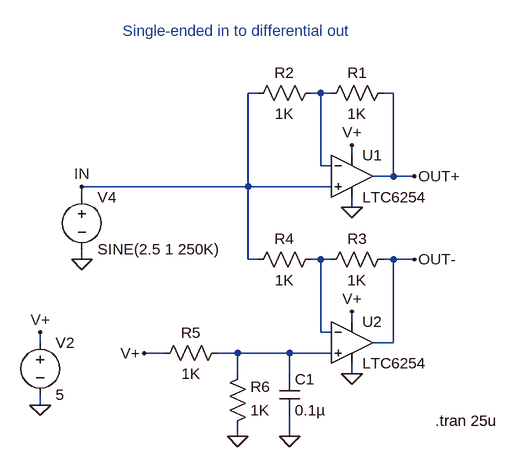
[diagram p0: schematic 6254.asc]
6254.asc, the LTspice schematic file:
Version 4
SHEET 1 1240 700
WIRE 416 -1232 400 -1232
WIRE 512 -1232 496 -1232
WIRE 528 -1232 512 -1232
WIRE 624 -1232 608 -1232
WIRE 560 -1136 560 -1152
WIRE 512 -1120 512 -1232
WIRE 528 -1120 512 -1120
WIRE 624 -1104 624 -1232
WIRE 624 -1104 592 -1104
WIRE 656 -1104 624 -1104
WIRE 400 -1088 400 -1232
WIRE 400 -1088 144 -1088
WIRE 528 -1088 400 -1088
WIRE 144 -1072 144 -1088
WIRE 560 -1056 560 -1072
WIRE 144 -976 144 -992
WIRE 400 -976 400 -1088
WIRE 416 -976 400 -976
WIRE 512 -976 496 -976
WIRE 528 -976 512 -976
WIRE 624 -976 608 -976
WIRE 656 -976 624 -976
WIRE 560 -880 560 -896
WIRE 512 -864 512 -976
WIRE 528 -864 512 -864
WIRE 80 -848 80 -864
WIRE 624 -848 624 -976
WIRE 624 -848 592 -848
WIRE 272 -832 240 -832
WIRE 384 -832 352 -832
WIRE 464 -832 384 -832
WIRE 528 -832 464 -832
WIRE 384 -800 384 -832
WIRE 464 -800 464 -832
WIRE 560 -800 560 -816
WIRE 80 -752 80 -768
WIRE 384 -704 384 -720
WIRE 464 -704 464 -736
FLAG 80 -864 V+
FLAG 80 -752 0
FLAG 144 -976 0
FLAG 656 -1104 OUT+
FLAG 560 -1152 V+
FLAG 560 -1056 0
FLAG 144 -1088 IN
FLAG 560 -896 V+
FLAG 560 -800 0
FLAG 656 -976 OUT-
FLAG 240 -832 V+
FLAG 464 -704 0
FLAG 384 -704 0
SYMBOL voltage 80 -864 R0
SYMATTR InstName V2
SYMATTR Value 5
SYMBOL voltage 144 -1088 R0
WINDOW 123 24 146 Left 0
WINDOW 39 24 125 Left 0
SYMATTR InstName V4
SYMATTR Value SINE(2.5 1 250K)
SYMBOL res 624 -1248 R90
WINDOW 0 0 56 VBottom 0
WINDOW 3 32 56 VTop 0
SYMATTR InstName R1
SYMATTR Value 1K
SYMBOL res 512 -1248 R90
WINDOW 0 0 56 VBottom 0
WINDOW 3 32 56 VTop 0
SYMATTR InstName R2
SYMATTR Value 1K
SYMBOL res 624 -992 R90
WINDOW 0 0 56 VBottom 0
WINDOW 3 32 56 VTop 0
SYMATTR InstName R3
SYMATTR Value 1K
SYMBOL res 512 -992 R90
WINDOW 0 0 56 VBottom 0
WINDOW 3 32 56 VTop 0
SYMATTR InstName R4
SYMATTR Value 1K
SYMBOL res 368 -848 R90
WINDOW 0 0 56 VBottom 0
WINDOW 3 32 56 VTop 0
SYMATTR InstName R5
SYMATTR Value 1K
SYMBOL res 368 -704 M180
WINDOW 0 36 76 Left 0
WINDOW 3 36 40 Left 0
SYMATTR InstName R6
SYMATTR Value 1K
SYMBOL cap 448 -800 R0
SYMATTR InstName C1
SYMATTR Value 0.1µ
SYMBOL Opamps\\LTC6254 560 -1104 R0
SYMATTR InstName U1
SYMBOL Opamps\\LTC6254 560 -848 R0
SYMATTR InstName U2
TEXT 688 -728 Left 0 !.tran 25u
TEXT 384 -1312 Bottom 0 ;Single-ended in to differential out

The netlist it stands for:
* 6254.asc
V2 V+ 0 5
V4 IN 0 SINE(2.5 1 250K)
R1 OUT+ N001 1K
R2 N001 IN 1K
R3 OUT- N002 1K
R4 N002 IN 1K
R5 N003 V+ 1K
R6 0 N003 1K
C1 N003 0 0.1µ
* U1: LTC6254 (symbol Opamps\LTC6254 not available, pins judged from their places): In+=IN In-=N001 V+=V+ V-=0 OUT=OUT+
* U2: LTC6254 (symbol Opamps\LTC6254 not available, pins judged from their places): In+=N003 In-=N002 V+=V+ V-=0 OUT=OUT-
.tran 25u
* Single-ended in to differential out
.backanno
.end